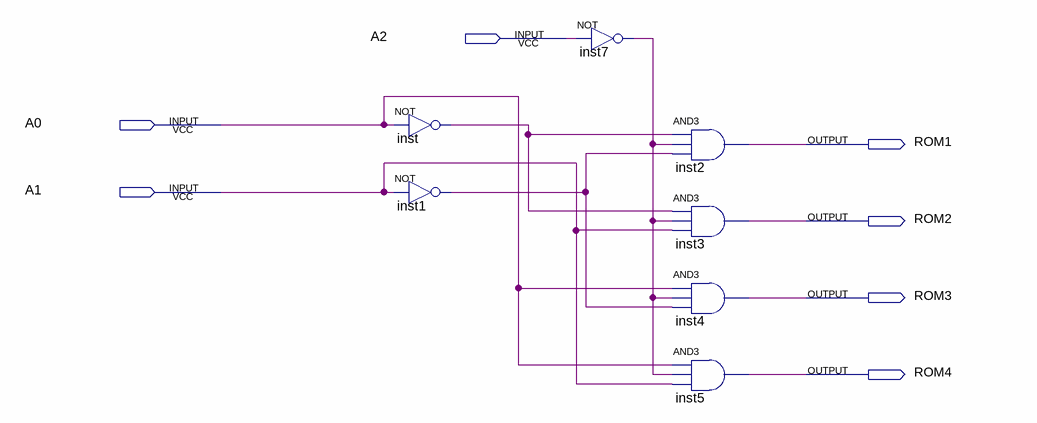
[diagram p0: schematic sheet]
// Quartus schematic 2_4_decoder.bdf as structural Verilog: 7 symbols, 7 pins
module \2_4_decoder  (
  input  A2,
  input  A0,
  input  A1,
  output ROM1,
  output ROM2,
  output ROM3,
  output ROM4
);

  wire inst1_out, inst7_out, inst_out;

  not inst (inst_out, A0);
  not inst1 (inst1_out, A1);
  not inst7 (inst7_out, A2);
  and inst2 (ROM1, inst_out, inst7_out, inst1_out);
  and inst3 (ROM2, inst_out, inst7_out, A1);
  and inst4 (ROM3, A0, inst7_out, inst1_out);
  and inst5 (ROM4, A0, inst7_out, A1);
endmodule
